# EAGLE design Joystick (EAGLE 5.04)
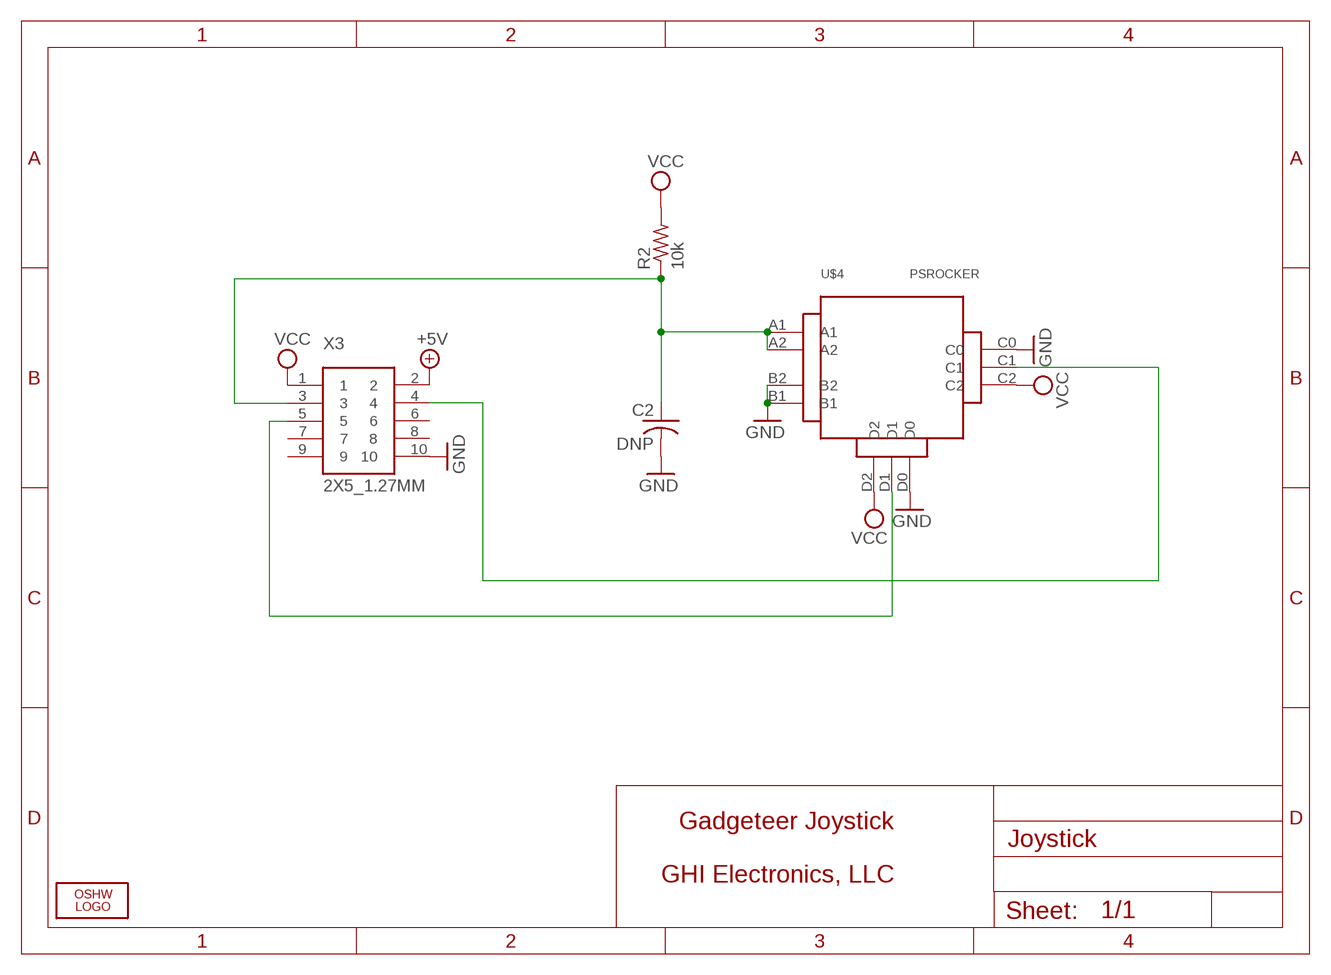
[diagram p0: schematic, sheet 1]

## Parts
C2  DNP  C-USC0603K  [C0603K]
LOGO1  LOGO-OSHW-FILLX0200-NT  [OSHW_FILLX200_NOTEXT]
R2  10k  R-US_R0603  [R0603]
U$4  PSROCKER  [PSROCKER]
X3  2X5_1.27MM  [2X5_1.27MM]

## Nets
+5V [power]: X3.2
GND [power]: C2.2 U$4.B1 U$4.B2 U$4.C0 U$4.D0 X3.10
N$3: C2.1 R2.1 U$4.A1 U$4.A2 X3.3
N$5: U$4.D1 X3.5
N$6: U$4.C1 X3.4
VCC [power]: R2.2 U$4.C2 U$4.D2 X3.1
Unconnected: X3.6 X3.7 X3.8 X3.9

## Notes on the sheet
- Gadgeteer Joystick
- GHI Electronics, LLC

## Library data of the parts
C2 = rcl:C-US: CAPACITOR, American symbol
LOGO1 = Logo:LOGO-OSHW-FILL
R2 = rcl:R-US_: RESISTOR, American symbol
U$4 = AnlogDevice:PSROCKER
X3 = GHI:2X5_1.27MM

## Net classes
0 default: width 0.254 mm, drill 0.381 mm, clearance 0.203 mm

## Board
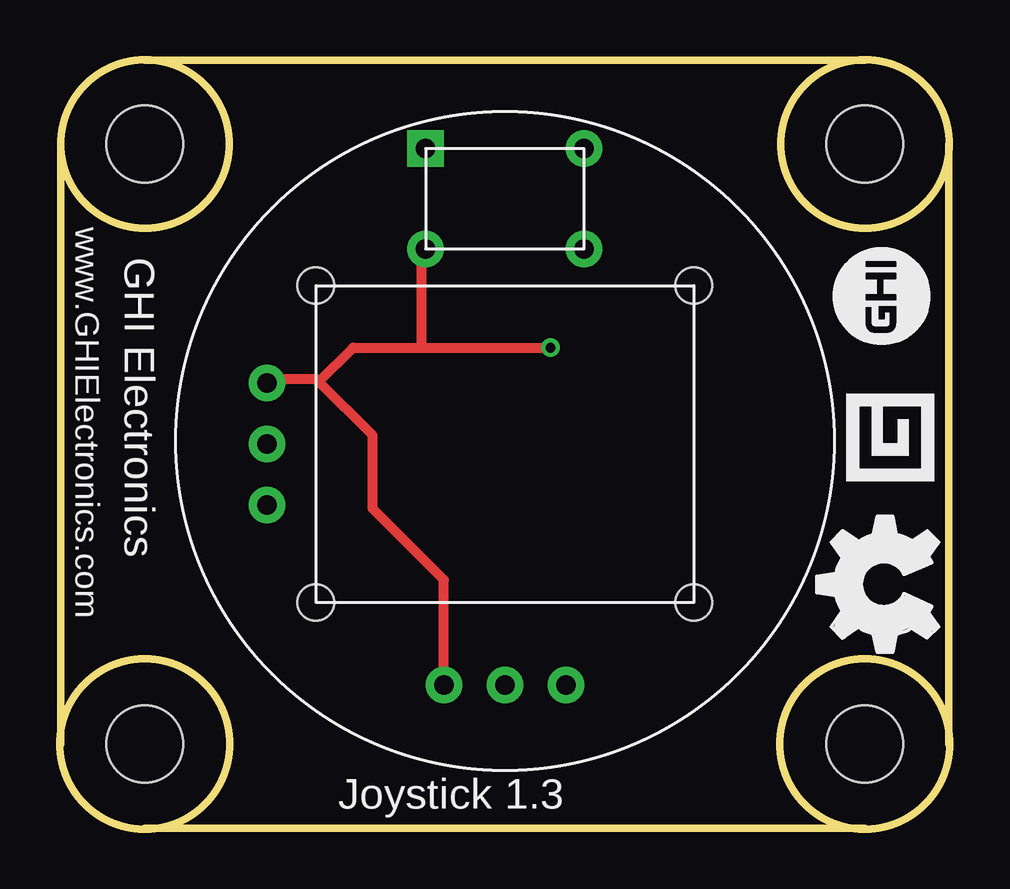
[diagram p1: board, top side]
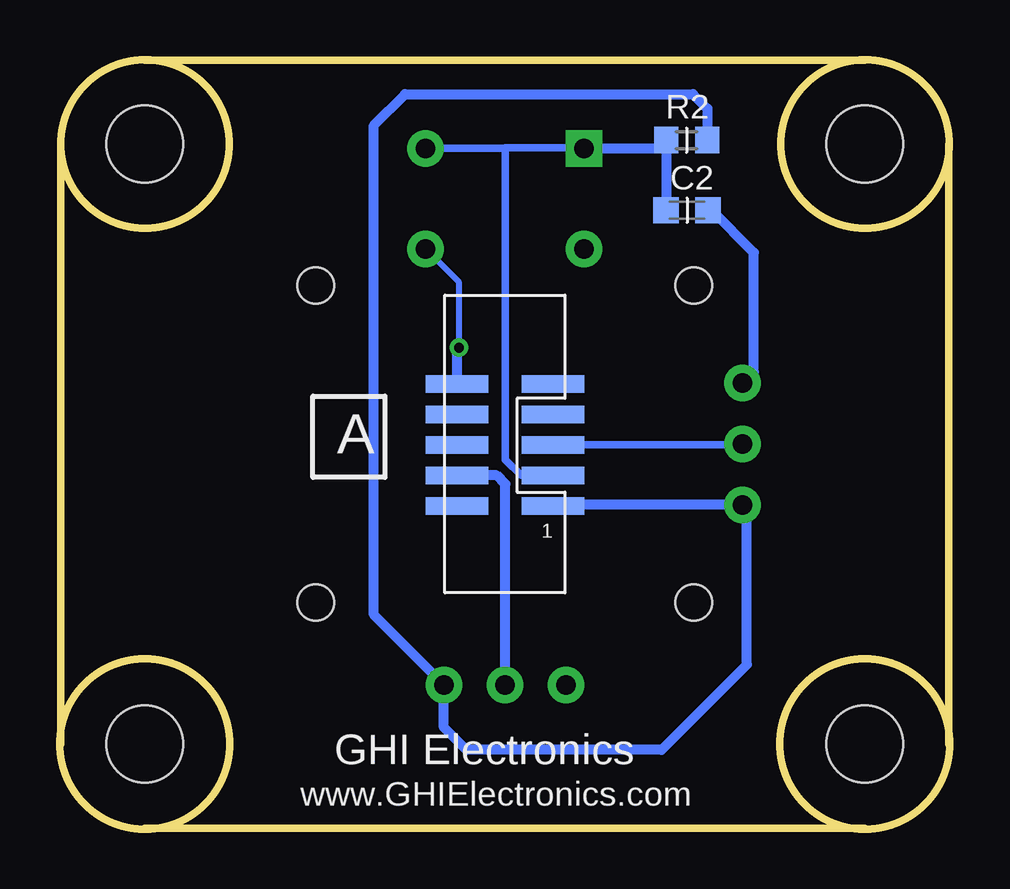
[diagram p2: board, bottom side, seen from below]

Size 37.07 x 32.04 mm. Coordinates in mm from the lower left corner, seen from the top.
Outline: 37.04,3.54 37.04,28.54
Outline: 0.04,28.54 0.04,3.54
Outline: 3.54,32.04 33.54,32.04
Outline: 33.54,0.04 3.54,0.04
Outline: circle at 3.54,28.54 radius 3.5
Outline: circle at 33.54,28.54 radius 3.5
Outline: circle at 33.54,3.54 radius 3.54
Outline: circle at 3.54,3.54 radius 3.54
Copper layers (1+16): Top 0.035mm / dielectric 1.5mm / Bottom 0.035mm
Design rules "default *": minimum track width 8mil, minimum drill 12mil, track to track 8mil, track to pad 8mil, pad to pad 8mil, via to via 8mil, smd to smd 8mil, copper to edge 15mil, drill to drill 8mil, minimum pad ring 10mil, minimum via ring 7mil, stop-mask expansion 4mil, vias tented up to drill 50mil, thermal gap 10mil
Holes 3.2 mm at 3.54,3.54 33.54,28.54 3.54,28.54 33.54,3.54

### Footprints (pad centres in the part's own frame; a part is rotated, then mirrored left to right if it is on the bottom)
C0603K = smd 1.05 x 1.08: 1 -0.875,0; 2 0.875,0
R0603 = smd 1 x 1.1: 1 -0.85,0; 2 0.85,0
PSROCKER = drill 0.813 pad 1.524 square: A1 -3.302,12.319 | drill 0.813 pad 1.524 round: A2 3.302,12.319; B1 -3.302,8.128; B2 3.302,8.128; C0 -2.54,-10.033; C1 0,-10.033; C2 2.54,-10.033; D0 -9.906,2.54; D1 -9.906,0; D2 -9.906,-2.54 | hole 1.524: -7.874,6.604; 7.874,6.604; 7.874,-6.604; -7.874,-6.604
2X5_1.27MM = smd 2.6 x 0.74: 1 -2,2.58; 2 2,2.58; 3 -2,1.31; 4 2,1.31; 5 -2,0.04; 6 2,0.04; 7 -2,-1.23; 8 2,-1.23; 9 -2,-2.5; 10 2,-2.5

### Placement (x,y rotation side)
C2  10.94,25.77 0 bottom
LOGO1  36.61,7.35 90 top
R2  10.96,28.7 0 bottom
U$4  18.54,16.04 0 top
X3  18.54,16.04 180 bottom

### Tracks (layer width: path | path; a pad name or v marks a point on that pad's centre or on a via)
GND  (via drill 0.41)
  Top 0.406: U$4.C0 16,10.37 13.02,13.35 13.02,16.39 10.79,18.63 | 10.79,18.63 10.69,18.73 8.78,18.73 U$4.D0 | 15.07,20.05 v20.44,20.05 | 10.79,18.63 12.21,20.05 15.07,20.05 | 15.07,20.05 15.07,24 U$4.B1
  Bottom 0.254: v20.44,20.05 20.44,22.77 U$4.B2
  Bottom 0.406: X3.10 20.54,19.96 v20.44,20.05 | C2.2 9.92,25.77 8.16,24.01 8.16,19.04 U$4.D0
N$3
  Bottom 0.305: X3.3 17.86,14.73 18.51,15.38 18.51,28.37 18.53,28.38 | 18.53,28.38 15.26,28.38 U$4.A1 | U$4.A2 18.55,28.35 18.53,28.38
  Bottom 0.406: U$4.A1 12.15,28.35 R2.1 C2.1
N$5
  Bottom 0.305: X3.5 8.67,16 U$4.D1
N$6
  Bottom 0.406: X3.4 18.88,14.73 18.51,14.36 18.51,6.03 U$4.C1
VCC
  Bottom 0.406: X3.1 16.5,13.5 U$4.D2 8.45,13.32 8.45,6.84 12.01,3.29 20.14,3.29 21.08,4.23 U$4.C2 24,8.92 24,29.31 22.69,30.62 10.7,30.62 10.09,30.01 10.09,28.71 R2.2

### Text on the board
tPlace: www.GHIElectronics.com | GHI Electronics | Joystick 1.3 | black PCB with white text | corner holes are nonplated | do not add manufacturing codes
bPlace: A | GHI Electronics | www.GHIElectronics.com
201bmp: C:/Users/Gus Issa/Desktop/GHILogo_BW.bmp